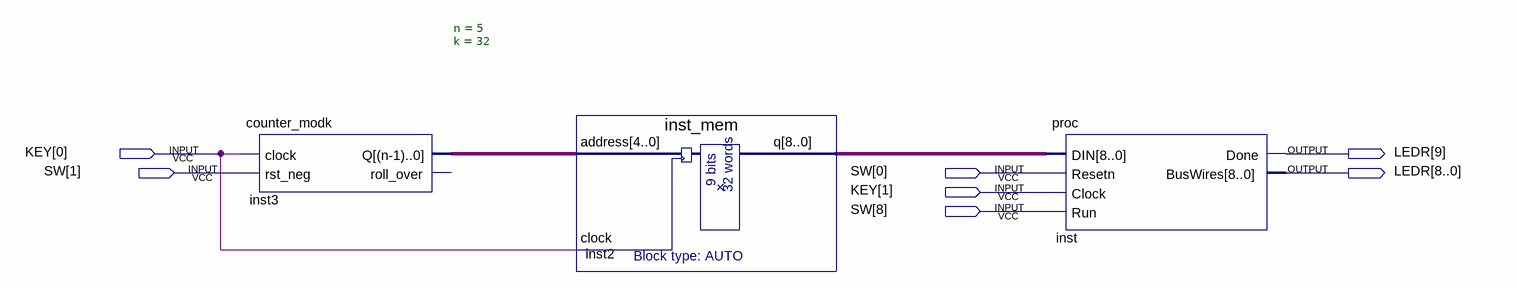
[diagram p0: schematic sheet]
// Quartus schematic Lab9Part2 _Tested.bdf as structural Verilog: 3 symbols, 7 pins
module \Lab9Part2__Tested  (
  input  [1:0] KEY,
  input  [8:0] SW,
  output [9:0] LEDR
);

  wire [4:0] inst3_q;
  wire [8:0] inst2_q;

  counter_modk #(.n(5), .k(32)) inst3 (.clock(KEY[0]), .rst_neg(SW[1]), .Q(inst3_q));  // open: roll_over
  inst_mem inst2 (.address(inst3_q), .clock(KEY[0]), .q(inst2_q));
  proc inst (.DIN(inst2_q), .Resetn(SW[0]), .Clock(KEY[1]), .Run(SW[8]), .Done(LEDR[9]), .BusWires(LEDR[8:0]));
endmodule
